# Altium project WiFi无线门禁_主机.PrjPCB
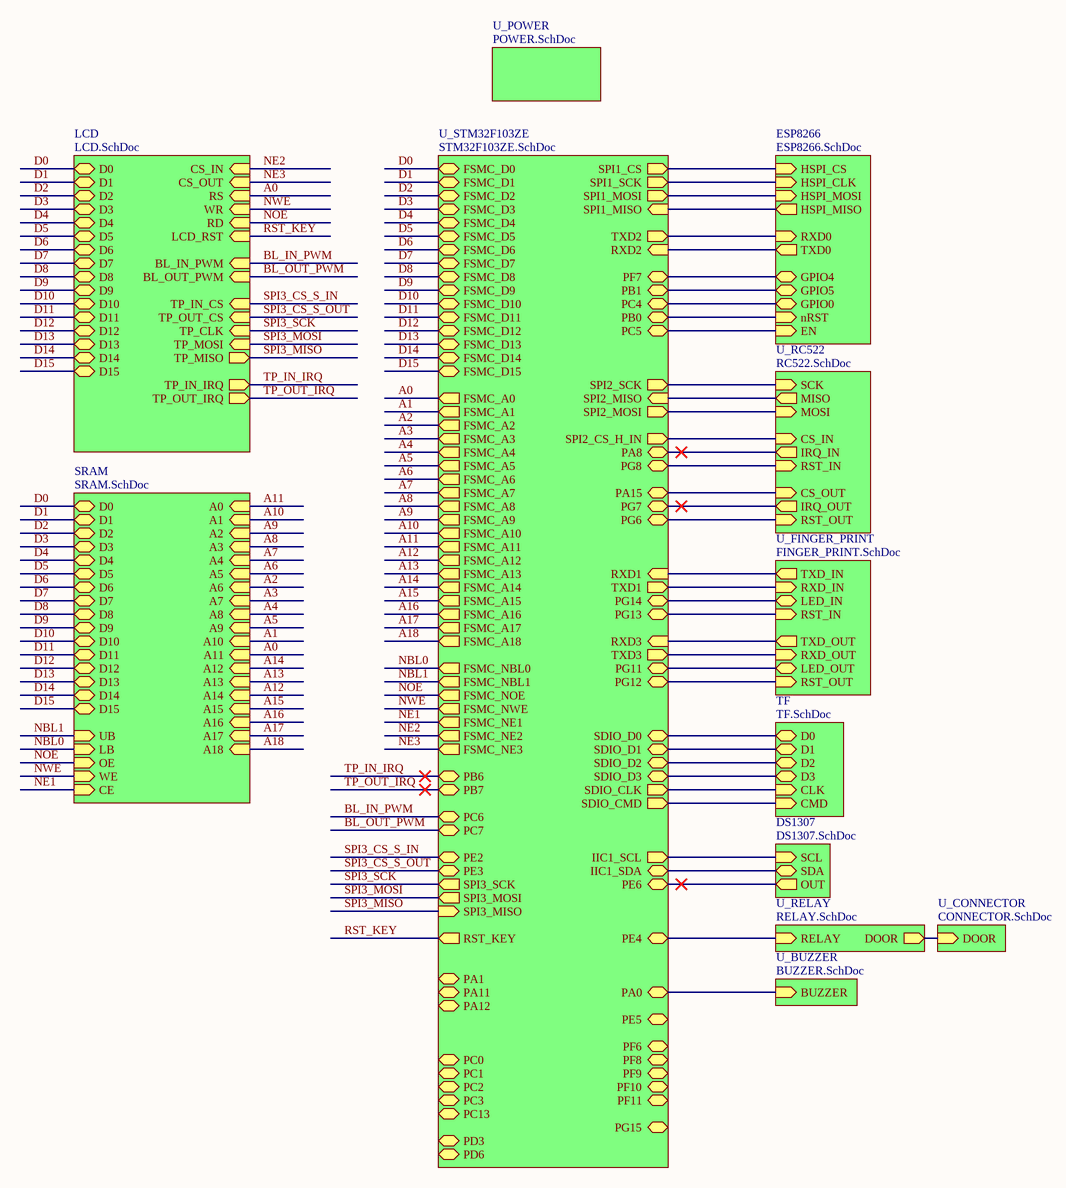
[diagram p0: WiFi无线门禁_主机.SchDoc]
13 sheets, 105 parts. Net scope: hierarchical (ports join the sheet entries above them; power ports are global).
Board file: WiFi无线门禁_主机.PcbDoc
Sheets:
  WiFi无线门禁_主机.SchDoc
    ESP8266 = ESP8266.SchDoc
    LCD = LCD.SchDoc
    TF = TF.SchDoc
    SRAM = SRAM.SchDoc
    DS1307 = DS1307.SchDoc
    U_RC522 = RC522.SchDoc
    U_FINGER_PRINT = FINGER_PRINT.SchDoc
    U_BUZZER = BUZZER.SchDoc
    U_RELAY = RELAY.SchDoc
    U_POWER = POWER.SchDoc
    U_STM32F103ZE = STM32F103ZE.SchDoc
    U_CONNECTOR = CONNECTOR.SchDoc

## Sheet WiFi无线门禁_主机.SchDoc
size A3

### Sub-sheets
DS1307 = DS1307.SchDoc: SCL (in), SDA (bidir), OUT (out)
ESP8266 = ESP8266.SchDoc: HSPI_CS (in), HSPI_CLK (in), HSPI_MISO (out), HSPI_MOSI (in), EN (in), nRST (in), TXD0 (out), RXD0 (in), GPIO5 (bidir), GPIO0 (bidir), GPIO4 (bidir)
LCD = LCD.SchDoc: D0 (bidir), D1 (bidir), D2 (bidir), D3 (bidir), D4 (bidir), D5 (bidir), D6 (bidir), D7 (bidir), D8 (bidir), D9 (bidir), D10 (bidir), D11 (bidir), D12 (bidir), D13 (bidir), D14 (bidir), D15 (bidir), CS_IN (in), RS (in), WR (in), RD (in), LCD_RST (in), BL_IN_PWM (in), TP_MISO (out), TP_MOSI (in), TP_CLK (in), TP_IN_CS (in), TP_IN_IRQ (out), CS_OUT (in), BL_OUT_PWM (in), TP_OUT_CS (in), TP_OUT_IRQ (out)
SRAM = SRAM.SchDoc: A0 (in), A1 (in), A2 (in), A3 (in), A4 (in), A5 (in), A6 (in), A7 (in), A8 (in), A9 (in), A10 (in), A11 (in), A12 (in), A13 (in), A14 (in), A15 (in), A16 (in), A17 (in), A18 (in), UB (in), LB (in), OE (in), WE (in), CE (in), D0 (bidir), D1 (bidir), D2 (bidir), D3 (bidir), D4 (bidir), D5 (bidir), D6 (bidir), D7 (bidir), D8 (bidir), D9 (bidir), D10 (bidir), D11 (bidir), D12 (bidir), D13 (bidir), D14 (bidir), D15 (bidir)
TF = TF.SchDoc: D2 (bidir), D3 (bidir), D0 (bidir), D1 (bidir), CMD (in), CLK (in)
U_BUZZER = BUZZER.SchDoc: BUZZER (in)
U_CONNECTOR = CONNECTOR.SchDoc: DOOR (in)
U_FINGER_PRINT = FINGER_PRINT.SchDoc: TXD_IN (out), RXD_IN (in), LED_IN (bidir), RST_IN (in), TXD_OUT (out), RXD_OUT (in), LED_OUT (bidir), RST_OUT (in)
U_POWER = POWER.SchDoc: no entries
U_RC522 = RC522.SchDoc: CS_IN (in), SCK (in), MOSI (in), MISO (out), IRQ_IN (out), RST_IN (in), CS_OUT (in), IRQ_OUT (out), RST_OUT (in)
U_RELAY = RELAY.SchDoc: RELAY (in), DOOR (out)
U_STM32F103ZE = STM32F103ZE.SchDoc: FSMC_D2 (bidir), FSMC_D3 (bidir), FSMC_D4 (bidir), FSMC_D5 (bidir), FSMC_D6 (bidir), FSMC_D7 (bidir), FSMC_D8 (bidir), FSMC_D9 (bidir), FSMC_D10 (bidir), FSMC_D11 (bidir), FSMC_D12 (bidir), FSMC_D13 (bidir), FSMC_D14 (bidir), FSMC_D15 (bidir), FSMC_D0 (bidir), FSMC_D1 (bidir), FSMC_A0 (out), FSMC_A1 (out), FSMC_A2 (out), FSMC_A3 (out), FSMC_A4 (out), FSMC_A5 (out), FSMC_A6 (out), FSMC_A7 (out), FSMC_A8 (out), FSMC_A9 (out), FSMC_A10 (out), FSMC_A11 (out), FSMC_A12 (out), FSMC_A13 (out), FSMC_A14 (out), FSMC_A15 (out), FSMC_A16 (out), FSMC_A17 (out), FSMC_A18 (out), FSMC_NBL0 (out), FSMC_NBL1 (out), FSMC_NOE (out), FSMC_NWE (out), FSMC_NE1 (out), FSMC_NE2 (out), FSMC_NE3 (out), RXD1 (in), TXD1 (out), RXD2 (in), TXD2 (out), RXD3 (in), TXD3 (out), SPI1_CS (out), SPI1_SCK (out), SPI1_MISO (in), SPI1_MOSI (out), SPI2_CS_H_IN (out), SPI2_SCK (out), SPI2_MISO (in), SPI2_MOSI (out), PB0 (bidir), SPI3_SCK (out), SPI3_MISO (in), SPI3_MOSI (out), SDIO_CMD (out), SDIO_D0 (bidir), SDIO_D1 (bidir), SDIO_D2 (bidir), SDIO_D3 (bidir), SDIO_CLK (out), PB1 (bidir), IIC1_SCL (out), IIC1_SDA (bidir), RST_KEY (out), PA0 (bidir), PA1 (bidir), PA8 (bidir), PA11 (bidir), PA12 (bidir), PA15 (bidir), PB6 (bidir), PB7 (bidir), PC0 (bidir), PC1 (bidir), PC2 (bidir), PC3 (bidir), PC4 (bidir), PC5 (bidir), PC6 (bidir), PC7 (bidir), PC13 (bidir), PD3 (bidir), PD6 (bidir), PE2 (bidir), PE3 (bidir), PE4 (bidir), PE5 (bidir), PE6 (bidir), PF7 (bidir), PF8 (bidir), PF9 (bidir), PF10 (bidir), PF11 (bidir), PF6 (bidir), PG6 (bidir), PG7 (bidir), PG8 (bidir), PG11 (bidir), PG12 (bidir), PG13 (bidir), PG14 (bidir), PG15 (bidir)

### Nets
A0: sheet LCD/RS, sheet SRAM/A11, sheet U_STM32F103ZE/FSMC_A0
A1: sheet SRAM/A10, sheet U_STM32F103ZE/FSMC_A1
A2: sheet SRAM/A6, sheet U_STM32F103ZE/FSMC_A2
A3: sheet SRAM/A7, sheet U_STM32F103ZE/FSMC_A3
A4: sheet SRAM/A8, sheet U_STM32F103ZE/FSMC_A4
A5: sheet SRAM/A9, sheet U_STM32F103ZE/FSMC_A5
A6: sheet SRAM/A5, sheet U_STM32F103ZE/FSMC_A6
A7: sheet SRAM/A4, sheet U_STM32F103ZE/FSMC_A7
A8: sheet SRAM/A3, sheet U_STM32F103ZE/FSMC_A8
A9: sheet SRAM/A2, sheet U_STM32F103ZE/FSMC_A9
A10: sheet SRAM/A1, sheet U_STM32F103ZE/FSMC_A10
A11: sheet SRAM/A0, sheet U_STM32F103ZE/FSMC_A11
A12: sheet SRAM/A14, sheet U_STM32F103ZE/FSMC_A12
A13: sheet SRAM/A13, sheet U_STM32F103ZE/FSMC_A13
A14: sheet SRAM/A12, sheet U_STM32F103ZE/FSMC_A14
A15: sheet SRAM/A15, sheet U_STM32F103ZE/FSMC_A15
A16: sheet SRAM/A16, sheet U_STM32F103ZE/FSMC_A16
A17: sheet SRAM/A17, sheet U_STM32F103ZE/FSMC_A17
A18: sheet SRAM/A18, sheet U_STM32F103ZE/FSMC_A18
BL_IN_PWM: sheet LCD/BL_IN_PWM, sheet U_STM32F103ZE/PC6
BL_OUT_PWM: sheet LCD/BL_OUT_PWM, sheet U_STM32F103ZE/PC7
D0: sheet LCD/D0, sheet SRAM/D0, sheet U_STM32F103ZE/FSMC_D0
D1: sheet LCD/D1, sheet SRAM/D1, sheet U_STM32F103ZE/FSMC_D1
D2: sheet LCD/D2, sheet SRAM/D2, sheet U_STM32F103ZE/FSMC_D2
D3: sheet LCD/D3, sheet SRAM/D3, sheet U_STM32F103ZE/FSMC_D3
D4: sheet LCD/D4, sheet SRAM/D4, sheet U_STM32F103ZE/FSMC_D4
D5: sheet LCD/D5, sheet SRAM/D5, sheet U_STM32F103ZE/FSMC_D5
D6: sheet LCD/D6, sheet SRAM/D6, sheet U_STM32F103ZE/FSMC_D6
D7: sheet LCD/D7, sheet SRAM/D7, sheet U_STM32F103ZE/FSMC_D7
D8: sheet LCD/D8, sheet SRAM/D8, sheet U_STM32F103ZE/FSMC_D8
D9: sheet LCD/D9, sheet SRAM/D9, sheet U_STM32F103ZE/FSMC_D9
D10: sheet LCD/D10, sheet SRAM/D10, sheet U_STM32F103ZE/FSMC_D10
D11: sheet LCD/D11, sheet SRAM/D11, sheet U_STM32F103ZE/FSMC_D11
D12: sheet LCD/D12, sheet SRAM/D12, sheet U_STM32F103ZE/FSMC_D12
D13: sheet LCD/D13, sheet SRAM/D13, sheet U_STM32F103ZE/FSMC_D13
D14: sheet LCD/D14, sheet SRAM/D14, sheet U_STM32F103ZE/FSMC_D14
D15: sheet LCD/D15, sheet SRAM/D15, sheet U_STM32F103ZE/FSMC_D15
EN: sheet ESP8266/EN, sheet U_STM32F103ZE/PC5
ESP8266_RST: sheet ESP8266/nRST, sheet U_STM32F103ZE/PB0
GPIO0: sheet ESP8266/GPIO0, sheet U_STM32F103ZE/PC4
GPIO4: sheet ESP8266/GPIO4, sheet U_STM32F103ZE/PF7
GPIO5: sheet ESP8266/GPIO5, sheet U_STM32F103ZE/PB1
GPIO12: sheet ESP8266/HSPI_MISO, sheet U_STM32F103ZE/SPI1_MISO
GPIO13: sheet ESP8266/HSPI_MOSI, sheet U_STM32F103ZE/SPI1_MOSI
GPIO14: sheet ESP8266/HSPI_CLK, sheet U_STM32F103ZE/SPI1_SCK
GPIO15: sheet ESP8266/HSPI_CS, sheet U_STM32F103ZE/SPI1_CS
NBL0: sheet SRAM/LB, sheet U_STM32F103ZE/FSMC_NBL0
NBL1: sheet SRAM/UB, sheet U_STM32F103ZE/FSMC_NBL1
NE1: sheet SRAM/CE, sheet U_STM32F103ZE/FSMC_NE1
NE2: sheet LCD/CS_IN, sheet U_STM32F103ZE/FSMC_NE2
NE3: sheet LCD/CS_OUT, sheet U_STM32F103ZE/FSMC_NE3
NOE: sheet LCD/RD, sheet SRAM/OE, sheet U_STM32F103ZE/FSMC_NOE
NWE: sheet LCD/WR, sheet SRAM/WE, sheet U_STM32F103ZE/FSMC_NWE
RST_KEY: sheet LCD/LCD_RST, sheet U_STM32F103ZE/RST_KEY  [project net nRST]
SPI3_CS_S_IN: sheet LCD/TP_IN_CS, sheet U_STM32F103ZE/PE2
SPI3_CS_S_OUT: sheet LCD/TP_OUT_CS, sheet U_STM32F103ZE/PE3
SPI3_MISO: sheet LCD/TP_MISO, sheet U_STM32F103ZE/SPI3_MISO
SPI3_MOSI: sheet LCD/TP_MOSI, sheet U_STM32F103ZE/SPI3_MOSI
SPI3_SCK: sheet LCD/TP_CLK, sheet U_STM32F103ZE/SPI3_SCK
TP_IN_IRQ: sheet LCD/TP_IN_IRQ, sheet U_STM32F103ZE/PB6
TP_OUT_IRQ: sheet LCD/TP_OUT_IRQ, sheet U_STM32F103ZE/PB7
NetDOOR_4: sheet U_RELAY/DOOR, sheet U_CONNECTOR/DOOR
NetFINGER_IN_3: sheet U_FINGER_PRINT/TXD_IN, sheet U_STM32F103ZE/RXD1
NetFINGER_IN_4: sheet U_FINGER_PRINT/RXD_IN, sheet U_STM32F103ZE/TXD1
NetFINGER_IN_5: sheet U_FINGER_PRINT/LED_IN, sheet U_STM32F103ZE/PG14
NetFINGER_IN_6: sheet U_FINGER_PRINT/RST_IN, sheet U_STM32F103ZE/PG13
NetFINGER_OUT_3: sheet U_FINGER_PRINT/TXD_OUT, sheet U_STM32F103ZE/RXD3
NetFINGER_OUT_4: sheet U_FINGER_PRINT/RXD_OUT, sheet U_STM32F103ZE/TXD3
NetFINGER_OUT_5: sheet U_FINGER_PRINT/LED_OUT, sheet U_STM32F103ZE/PG11
NetFINGER_OUT_6: sheet U_FINGER_PRINT/RST_OUT, sheet U_STM32F103ZE/PG12
NetMY1_3: sheet U_RELAY/RELAY, sheet U_STM32F103ZE/PE4
NetRB1_2: sheet U_BUZZER/BUZZER, sheet U_STM32F103ZE/PA0
NetRC522_IN_2: sheet U_RC522/RST_IN, sheet U_STM32F103ZE/PG8
NetRC522_IN_4: sheet U_RC522/IRQ_IN, sheet U_STM32F103ZE/PA8
NetRC522_IN_5: sheet U_RC522/MISO, sheet U_STM32F103ZE/SPI2_MISO
NetRC522_IN_6: sheet U_RC522/MOSI, sheet U_STM32F103ZE/SPI2_MOSI
NetRC522_IN_7: sheet U_RC522/SCK, sheet U_STM32F103ZE/SPI2_SCK
NetRC522_IN_8: sheet U_RC522/CS_IN, sheet U_STM32F103ZE/SPI2_CS_H_IN
NetRC522_OUT_2: sheet U_RC522/RST_OUT, sheet U_STM32F103ZE/PG6
NetRC522_OUT_4: sheet U_RC522/IRQ_OUT, sheet U_STM32F103ZE/PG7
NetRC522_OUT_8: sheet U_RC522/CS_OUT, sheet U_STM32F103ZE/PA15
NetRD1_1: sheet DS1307/SDA, sheet U_STM32F103ZE/IIC1_SDA
NetRD2_1: sheet DS1307/SCL, sheet U_STM32F103ZE/IIC1_SCL
NetRD3_2: sheet DS1307/OUT, sheet U_STM32F103ZE/PE6
NetRE2_2: sheet ESP8266/TXD0, sheet U_STM32F103ZE/RXD2
NetRE3_2: sheet ESP8266/RXD0, sheet U_STM32F103ZE/TXD2
NetRT1_2: sheet TF/D2, sheet U_STM32F103ZE/SDIO_D2
NetRT2_2: sheet TF/D3, sheet U_STM32F103ZE/SDIO_D3
NetRT3_2: sheet TF/CMD, sheet U_STM32F103ZE/SDIO_CMD
NetRT4_2: sheet TF/CLK, sheet U_STM32F103ZE/SDIO_CLK
NetRT5_2: sheet TF/D0, sheet U_STM32F103ZE/SDIO_D0
NetRT6_2: sheet TF/D1, sheet U_STM32F103ZE/SDIO_D1

## Sheet ESP8266.SchDoc
size A4
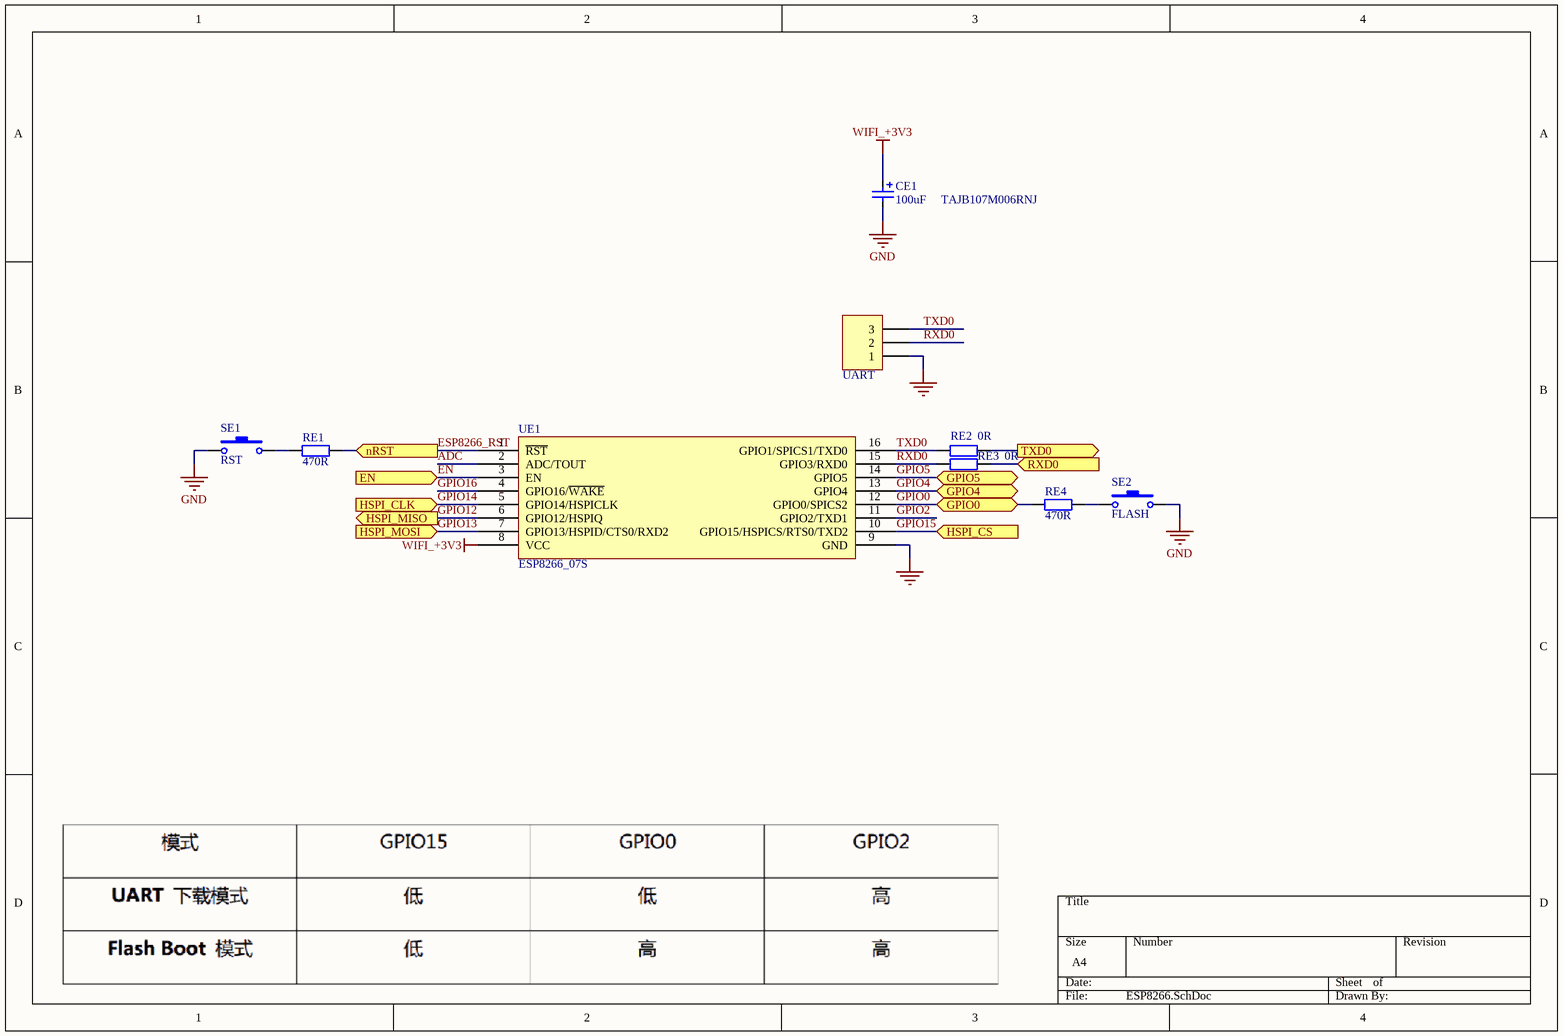
[diagram p1: ESP8266.SchDoc]

### Parts
CE1  value 100uF     TAJB107M006RNJ  [CAP_TAN_B_3518]  (hidden comment: Cap_Tan)
RE1  value 470R  [RESC1608N]  (hidden comment: Res1)
RE2  value 0R  [RESC1608N]  (hidden comment: Res1)
RE3  value 0R  [RESC1608N]  (hidden comment: Res1)
RE4  value 470R  [RESC1608N]  (hidden comment: Res1)
SE1  RST  [SW-3x6]
SE2  FLASH  [SW-3x6]
UART  Header 3  [HDR1X3]  (value not drawn)
UE1  ESP8266_07S  [ESP8266_07S]

### Ports
EN (in), GPIO0 (bidir), GPIO4 (bidir), GPIO5 (bidir), HSPI_CLK (in), HSPI_CS (in), HSPI_MISO (out), HSPI_MOSI (in), nRST (in), RXD0 (in), TXD0 (out)

### Nets
GND: CE1.2 SE1.2 SE2.2 UART.1 UE1.9(GND)
WIFI_+3V3: CE1.1 UE1.8(VCC)
ADC: UE1.2(ADC/TOUT)
EN: UE1.3(EN) ; port EN
ESP8266_RST: RE1.1 UE1.1(~{RST}) ; port nRST
GPIO0: RE4.1 UE1.12(GPIO0/SPICS2) ; port GPIO0
GPIO2: UE1.11(GPIO2/TXD1)
GPIO4: UE1.13(GPIO4) ; port GPIO4
GPIO5: UE1.14(GPIO5) ; port GPIO5
GPIO12: UE1.6(GPIO12/HSPIQ) ; port HSPI_MISO
GPIO13: UE1.7(GPIO13/HSPID/CTS0/RXD2) ; port HSPI_MOSI
GPIO14: UE1.5(GPIO14/HSPICLK) ; port HSPI_CLK
GPIO15: UE1.10(GPIO15/HSPICS/RTS0/TXD2) ; port HSPI_CS
GPIO16: UE1.4(GPIO16/~{WAKE})
RXD0: RE3.1 UART.2 UE1.15(GPIO3/RXD0)
TXD0: RE2.1 UART.3 UE1.16(GPIO1/SPICS1/TXD0)
NetRE1_2: RE1.2 SE1.1
NetRE2_2: RE2.2 ; port TXD0
NetRE3_2: RE3.2 ; port RXD0
NetRE4_2: RE4.2 SE2.1

### Library data of the parts
CE1 = Cap_Tan: Capacitor
RE1-RE4 = Res1: Resistor; Published: 8-Jun-2000; LatestRevisionDate: 17-Jul-2002; LatestRevisionNote: Re-released for DXP Platform.; PackageReference: AXIAL-0.4; Publisher: Altium Limited
SE1 SE2 = SW-PB: Switch; Published: 24-Mar-1999; LatestRevisionDate: 17-Jul-2002; LatestRevisionNote: Re-released for DXP Platform.; PackageReference: SPST-2; Publisher: Altium Limited; PackageDescription: Switch; 2 Leads
UART = Header 3: Header, 3-Pin; LatestRevisionDate: 17-Jul-2002; LatestRevisionNote: Re-released for DXP Platform.; Publisher: Altium Limited

## Sheet LCD.SchDoc
size A4
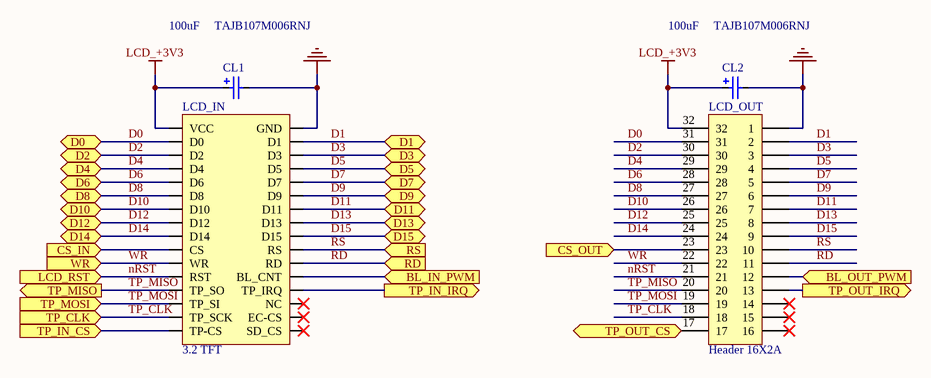
[diagram p2: LCD.SchDoc]

### Parts
CL1  value 100uF     TAJB107M006RNJ  [CAP_TAN_B_3518]  (hidden comment: Cap_Tan)
CL2  value 100uF     TAJB107M006RNJ  [CAP_TAN_B_3518]  (hidden comment: Cap_Tan)
LCD_IN  3.2 TFT  [LCD3.2]
LCD_OUT  Header 16X2A  [HDR2X16_CEN]

### Ports
BL_IN_PWM (in), BL_OUT_PWM (in), CS_IN (in), CS_OUT (in), D0 (bidir), D1 (bidir), D2 (bidir), D3 (bidir), D4 (bidir), D5 (bidir), D6 (bidir), D7 (bidir), D8 (bidir), D9 (bidir), D10 (bidir), D11 (bidir), D12 (bidir), D13 (bidir), D14 (bidir), D15 (bidir), LCD_RST (in), RD (in), RS (in), TP_CLK (in), TP_IN_CS (in), TP_IN_IRQ (out), TP_MISO (out), TP_MOSI (in), TP_OUT_CS (in), TP_OUT_IRQ (out), WR (in)

### Nets
GND: CL1.2 CL2.2 LCD_IN.2(GND) LCD_OUT.1
LCD_+3V3: CL1.1 CL2.1 LCD_IN.1(VCC) LCD_OUT.32
BL_IN_PWM: LCD_IN.24(BL_CNT) ; port BL_IN_PWM
BL_OUT_PWM: LCD_OUT.12 ; port BL_OUT_PWM
D0: LCD_IN.3(D0) LCD_OUT.31 ; port D0
D1: LCD_IN.4(D1) LCD_OUT.2 ; port D1
D2: LCD_IN.5(D2) LCD_OUT.30 ; port D2
D3: LCD_IN.6(D3) LCD_OUT.3 ; port D3
D4: LCD_IN.7(D4) LCD_OUT.29 ; port D4
D5: LCD_IN.8(D5) LCD_OUT.4 ; port D5
D6: LCD_IN.9(D6) LCD_OUT.28 ; port D6
D7: LCD_IN.10(D7) LCD_OUT.5 ; port D7
D8: LCD_IN.11(D8) LCD_OUT.27 ; port D8
D9: LCD_IN.12(D9) LCD_OUT.6 ; port D9
D10: LCD_IN.13(D10) LCD_OUT.26 ; port D10
D11: LCD_IN.14(D11) LCD_OUT.7 ; port D11
D12: LCD_IN.15(D12) LCD_OUT.25 ; port D12
D13: LCD_IN.16(D13) LCD_OUT.8 ; port D13
D14: LCD_IN.17(D14) LCD_OUT.24 ; port D14
D15: LCD_IN.18(D15) LCD_OUT.9 ; port D15
NE2: LCD_IN.19(CS) ; port CS_IN
NE3: LCD_OUT.23 ; port CS_OUT
nRST: LCD_IN.23(RST) LCD_OUT.21 ; port LCD_RST
RD: LCD_IN.22(RD) LCD_OUT.11 ; port RD  [project net NOE]
RS: LCD_IN.20(RS) LCD_OUT.10 ; port RS  [project net A0]
SPI3_CS_S_IN: LCD_IN.31(TP-CS) ; port TP_IN_CS
SPI3_CS_S_OUT: LCD_OUT.17 ; port TP_OUT_CS
TP_CLK: LCD_IN.29(TP_SCK) LCD_OUT.18 ; port TP_CLK  [project net SPI3_SCK]
TP_IN_IRQ: LCD_IN.26(TP_IRQ) ; port TP_IN_IRQ
TP_MISO: LCD_IN.25(TP_SO) LCD_OUT.20 ; port TP_MISO  [project net SPI3_MISO]
TP_MOSI: LCD_IN.27(TP_SI) LCD_OUT.19 ; port TP_MOSI  [project net SPI3_MOSI]
TP_OUT_IRQ: LCD_OUT.13 ; port TP_OUT_IRQ
WR: LCD_IN.21(WR) LCD_OUT.22 ; port WR  [project net NWE]

Not connected (* = marked no-connect by the designer): LCD_IN 28(NC)* 30(EC-CS)* 32(SD_CS)*; LCD_OUT 14* 15* 16*

### Library data of the parts
CL1 CL2 = Cap_Tan: Capacitor
LCD_IN = LCD3.2
LCD_OUT = Header 16X2A: Header, 16-Pin, Dual row; LatestRevisionDate: 17-Jul-2002; LatestRevisionNote: Re-released for DXP Platform.; Publisher: Altium Limited

## Sheet TF.SchDoc
size A4
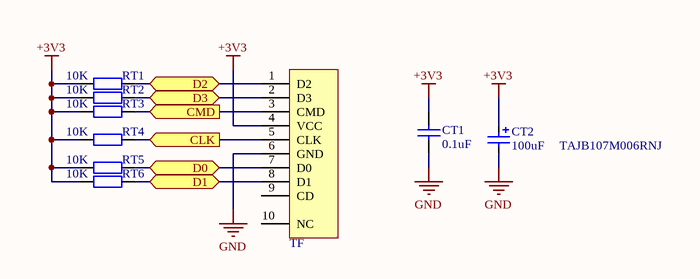
[diagram p3: TF.SchDoc]

### Parts
CT1  value 0.1uF  [CAPC1608N]  (hidden comment: Cap1)
CT2  value 100uF     TAJB107M006RNJ  [CAP_TAN_B_3518]  (hidden comment: Cap_Tan)
RT1  value 10K  [RESC1608N]  (hidden comment: Res1)
RT2  value 10K  [RESC1608N]  (hidden comment: Res1)
RT3  value 10K  [RESC1608N]  (hidden comment: Res1)
RT4  value 10K  [RESC1608N]  (hidden comment: Res1)
RT5  value 10K  [RESC1608N]  (hidden comment: Res1)
RT6  value 10K  [RESC1608N]  (hidden comment: Res1)
TF  TF  [TF-2]  (value not drawn)

### Ports
CLK (in), CMD (in), D0 (bidir), D1 (bidir), D2 (bidir), D3 (bidir)

### Nets
+3V3: CT1.2 CT2.1 RT1.1 RT2.1 RT3.1 RT4.1 RT5.1 RT6.1 TF.4(VCC)
GND: CT1.1 CT2.2 TF.6(GND)
NetRT1_2: RT1.2 TF.1(D2) ; port D2
NetRT2_2: RT2.2 TF.2(D3) ; port D3
NetRT3_2: RT3.2 TF.3(CMD) ; port CMD
NetRT4_2: RT4.2 TF.5(CLK) ; port CLK
NetRT5_2: RT5.2 TF.7(D0) ; port D0
NetRT6_2: RT6.2 TF.8(D1) ; port D1

Not connected (* = marked no-connect by the designer): TF 9(CD) 10(NC)

### Library data of the parts
CT1 = Cap1: Capacitor; Published: 8-Jun-2000; LatestRevisionDate: 17-Jul-2002; LatestRevisionNote: Re-released for DXP Platform.; PackageReference: RAD-0.3; Publisher: Altium Limited
CT2 = Cap_Tan: Capacitor
RT1-RT6 = Res1: Resistor; Published: 8-Jun-2000; LatestRevisionDate: 17-Jul-2002; LatestRevisionNote: Re-released for DXP Platform.; PackageReference: AXIAL-0.4; Publisher: Altium Limited
TF = TF2

## Sheet SRAM.SchDoc
size A4
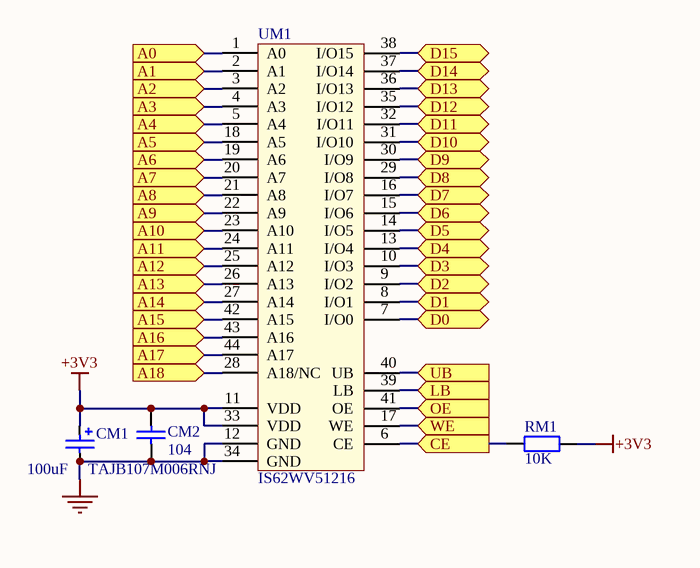
[diagram p4: SRAM.SchDoc]

### Parts
CM1  value 100uF     TAJB107M006RNJ  [CAP_TAN_B_3518]  (hidden comment: Cap_Tan)
CM2  value 104  [CAPC1608N]  (hidden comment: Cap1)
RM1  value 10K  [RESC1608N]  (hidden comment: Res1)
UM1  IS62WV51216  [TSOP44]

### Ports
A0 (in), A1 (in), A2 (in), A3 (in), A4 (in), A5 (in), A6 (in), A7 (in), A8 (in), A9 (in), A10 (in), A11 (in), A12 (in), A13 (in), A14 (in), A15 (in), A16 (in), A17 (in), A18 (in), CE (in), D0 (bidir), D1 (bidir), D2 (bidir), D3 (bidir), D4 (bidir), D5 (bidir), D6 (bidir), D7 (bidir), D8 (bidir), D9 (bidir), D10 (bidir), D11 (bidir), D12 (bidir), D13 (bidir), D14 (bidir), D15 (bidir), LB (in), OE (in), UB (in), WE (in)

### Nets
+3V3: CM1.1 CM2.2 RM1.1 UM1.11(VDD) UM1.33(VDD)
GND: CM1.2 CM2.1 UM1.12(GND) UM1.34(GND)
A0: UM1.24(A11) ; port A11
A1: UM1.23(A10) ; port A10
A2: UM1.19(A6) ; port A6
A3: UM1.20(A7) ; port A7
A4: UM1.21(A8) ; port A8
A5: UM1.22(A9) ; port A9
A6: UM1.18(A5) ; port A5
A7: UM1.5(A4) ; port A4
A8: UM1.4(A3) ; port A3
A9: UM1.3(A2) ; port A2
A10: UM1.2(A1) ; port A1
A11: UM1.1(A0) ; port A0
A12: UM1.27(A14) ; port A14
A13: UM1.26(A13) ; port A13
A14: UM1.25(A12) ; port A12
A15: UM1.42(A15) ; port A15
A16: UM1.43(A16) ; port A16
A17: UM1.44(A17) ; port A17
A18: UM1.28(A18/NC) ; port A18
D0: UM1.7(I/O0) ; port D0
D1: UM1.8(I/O1) ; port D1
D2: UM1.9(I/O2) ; port D2
D3: UM1.10(I/O3) ; port D3
D4: UM1.13(I/O4) ; port D4
D5: UM1.14(I/O5) ; port D5
D6: UM1.15(I/O6) ; port D6
D7: UM1.16(I/O7) ; port D7
D8: UM1.29(I/O8) ; port D8
D9: UM1.30(I/O9) ; port D9
D10: UM1.31(I/O10) ; port D10
D11: UM1.32(I/O11) ; port D11
D12: UM1.35(I/O12) ; port D12
D13: UM1.36(I/O13) ; port D13
D14: UM1.37(I/O14) ; port D14
D15: UM1.38(I/O15) ; port D15
NBL0: UM1.39(LB) ; port LB
NBL1: UM1.40(UB) ; port UB
NE1: RM1.2 UM1.6(CE) ; port CE
NOE: UM1.41(OE) ; port OE
NWE: UM1.17(WE) ; port WE

### Library data of the parts
CM1 = Cap_Tan: Capacitor
CM2 = Cap1: Capacitor; Published: 8-Jun-2000; LatestRevisionDate: 17-Jul-2002; LatestRevisionNote: Re-released for DXP Platform.; PackageReference: RAD-0.3; Publisher: Altium Limited
RM1 = Res1: Resistor; Published: 8-Jun-2000; LatestRevisionDate: 17-Jul-2002; LatestRevisionNote: Re-released for DXP Platform.; PackageReference: AXIAL-0.4; Publisher: Altium Limited
UM1 = IS61LV51216

## Sheet DS1307.SchDoc
size A4
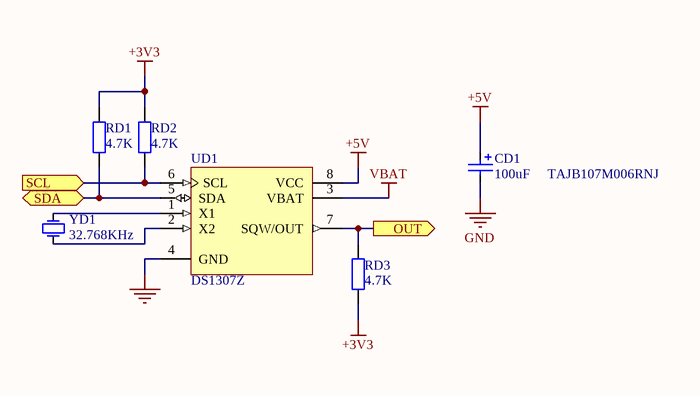
[diagram p5: DS1307.SchDoc]

### Parts
CD1  value 100uF     TAJB107M006RNJ  [CAP_TAN_B_3518]  (hidden comment: Cap_Tan)
RD1  value 4.7K  [RESC1608N]  (hidden comment: Res1)
RD2  value 4.7K  [RESC1608N]  (hidden comment: Res1)
RD3  value 4.7K  [RESC1608N]  (hidden comment: Res1)
UD1  DS1307Z  [SOIC8_L]
YD1  32.768KHz  [XTAL-206]

### Ports
OUT (out), SCL (in), SDA (bidir)

### Nets
+3V3: RD1.2 RD2.2 RD3.1
+5V: CD1.1 UD1.8(VCC)
GND: CD1.2 UD1.4(GND)
VBAT: UD1.3(VBAT)
NetRD1_1: RD1.1 UD1.5(SDA) ; port SDA
NetRD2_1: RD2.1 UD1.6(SCL) ; port SCL
NetRD3_2: RD3.2 UD1.7(SQW/OUT) ; port OUT
NetUD1_1: UD1.1(X1) YD1.2(OSC2)
NetUD1_2: UD1.2(X2) YD1.1(OSC1)

### Library data of the parts
CD1 = Cap_Tan: Capacitor
RD1-RD3 = Res1: Resistor; Published: 8-Jun-2000; LatestRevisionDate: 17-Jul-2002; LatestRevisionNote: Re-released for DXP Platform.; PackageReference: AXIAL-0.4; Publisher: Altium Limited
UD1 = DS1307Z: 64 X 8 Serial Real-Time Clock; Published: 13-Oct-2000; LatestRevisionDate: 13-Apr-2006; LatestRevisionNote: IPC-7351 Footprint Added.; DatasheetVersion: 10-Aug-1999; PackageVersion: 1999; PackageReference: SOIC8N; Publisher: Altium Limited; PackageDescription: 8-Pin Small Outline Integrated Circuit 1.27 mm Pitch; Code_IPC: SOIC127P600-8; ComponentLink1Description: Manufacturer Link; ComponentLink1URL: http://www.maxim-ic.com/; ComponentLink2Description: Datasheet; ComponentLink2URL: http://pdfserv.maxim-ic.com/en/ds/DS1307.pdf; ComponentLink3Description: Discontinuation Notice; ComponentLink3URL: http://www.maxim-ic.com/qa/pdfs/non-obsolescence-letter.pdf
YD1 = XTAL: Crystal Oscillator; Published: 8-Jun-2000; LatestRevisionDate: 17-Jul-2002; LatestRevisionNote: Re-released for DXP Platform.; PackageReference: R38; Publisher: Altium Limited; PackageDescription: Crystal, Thru-Hole; 2 Leads; Body 3.1 x 8.2 mm (Dia.xH)

## Sheet RC522.SchDoc
size A4
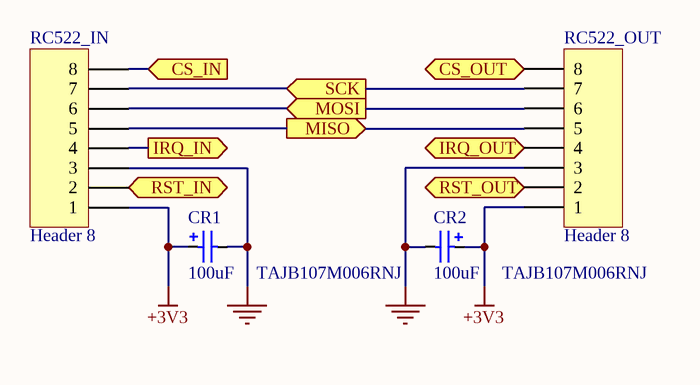
[diagram p6: RC522.SchDoc]

### Parts
CR1  value 100uF     TAJB107M006RNJ  [CAP_TAN_B_3518]  (hidden comment: Cap_Tan)
CR2  value 100uF     TAJB107M006RNJ  [CAP_TAN_B_3518]  (hidden comment: Cap_Tan)
RC522_IN  Header 8  [HX2.54-8]
RC522_OUT  Header 8  [HX2.54-8]

### Ports
CS_IN (in), CS_OUT (in), IRQ_IN (out), IRQ_OUT (out), MISO (out), MOSI (in), RST_IN (in), RST_OUT (in), SCK (in)

### Nets
+3V3: CR1.1 CR2.1 RC522_IN.1 RC522_OUT.1
GND: CR1.2 CR2.2 RC522_IN.3 RC522_OUT.3
NetRC522_IN_2: RC522_IN.2 ; port RST_IN
NetRC522_IN_4: RC522_IN.4 ; port IRQ_IN
NetRC522_IN_5: RC522_IN.5 RC522_OUT.5 ; port MISO
NetRC522_IN_6: RC522_IN.6 RC522_OUT.6 ; port MOSI
NetRC522_IN_7: RC522_IN.7 RC522_OUT.7 ; port SCK
NetRC522_IN_8: RC522_IN.8 ; port CS_IN
NetRC522_OUT_2: RC522_OUT.2 ; port RST_OUT
NetRC522_OUT_4: RC522_OUT.4 ; port IRQ_OUT
NetRC522_OUT_8: RC522_OUT.8 ; port CS_OUT

### Library data of the parts
CR1 CR2 = Cap_Tan: Capacitor
RC522_IN RC522_OUT = Header 8: Header, 8-Pin; LatestRevisionDate: 17-Jul-2002; LatestRevisionNote: Re-released for DXP Platform.; Publisher: Altium Limited

## Sheet FINGER_PRINT.SchDoc
size A4
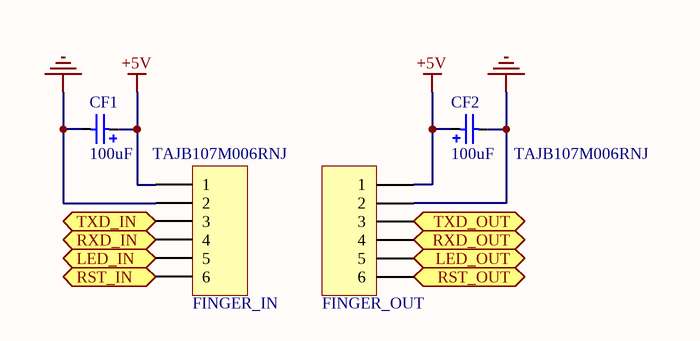
[diagram p7: FINGER_PRINT.SchDoc]

### Parts
CF1  value 100uF     TAJB107M006RNJ  [CAP_TAN_B_3518]  (hidden comment: Cap_Tan)
CF2  value 100uF     TAJB107M006RNJ  [CAP_TAN_B_3518]  (hidden comment: Cap_Tan)
FINGER_IN  Header 6  [HX2.54-6]  (value not drawn)
FINGER_OUT  Header 6  [HX2.54-6]  (value not drawn)

### Ports
LED_IN (bidir), LED_OUT (bidir), RST_IN (in), RST_OUT (in), RXD_IN (in), RXD_OUT (in), TXD_IN (out), TXD_OUT (out)

### Nets
+5V: CF1.1 CF2.1 FINGER_IN.1 FINGER_OUT.1
GND: CF1.2 CF2.2 FINGER_IN.2 FINGER_OUT.2
NetFINGER_IN_3: FINGER_IN.3 ; port TXD_IN
NetFINGER_IN_4: FINGER_IN.4 ; port RXD_IN
NetFINGER_IN_5: FINGER_IN.5 ; port LED_IN
NetFINGER_IN_6: FINGER_IN.6 ; port RST_IN
NetFINGER_OUT_3: FINGER_OUT.3 ; port TXD_OUT
NetFINGER_OUT_4: FINGER_OUT.4 ; port RXD_OUT
NetFINGER_OUT_5: FINGER_OUT.5 ; port LED_OUT
NetFINGER_OUT_6: FINGER_OUT.6 ; port RST_OUT

### Library data of the parts
CF1 CF2 = Cap_Tan: Capacitor
FINGER_IN FINGER_OUT = Header 6: Header, 6-Pin; LatestRevisionDate: 17-Jul-2002; LatestRevisionNote: Re-released for DXP Platform.; Publisher: Altium Limited

## Sheet BUZZER.SchDoc
size A4
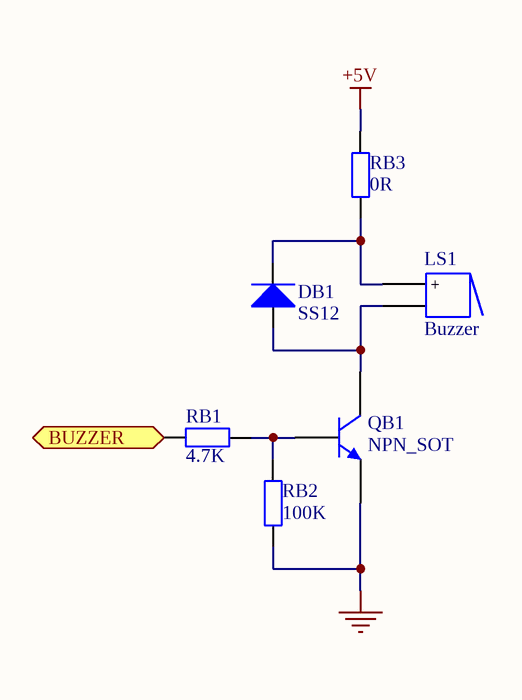
[diagram p8: BUZZER.SchDoc]

### Parts
DB1  SMA: SS12  [DO-214AC]  (hidden comment: Diode)
LS1  Buzzer  [Buzzer 5]
QB1  NPN_SOT  [SOT23_N]
RB1  value 4.7K  [RESC1608N]  (hidden comment: Res1)
RB2  value 100K  [RESC1608N]  (hidden comment: Res1)
RB3  value 0R  [RESC1608N]  (hidden comment: Res1)

### Ports
BUZZER (in)

### Nets
+5V: RB3.2
GND: QB1.2(E) RB2.2
NetDB1_1: DB1.1(A) LS1.2 QB1.1(C)
NetDB1_2: DB1.2(K) LS1.1(+) RB3.1
NetQB1_3: QB1.3(B) RB1.1 RB2.1
NetRB1_2: RB1.2 ; port BUZZER

### Library data of the parts
LS1 = Buzzer: Magnetic Transducer Buzzer; Published: 24-Mar-1999; LatestRevisionDate: 17-Dec-2003; LatestRevisionNote: Schematic revised, PCB Footprint replaced.; DatasheetVersion: 17-Dec-2003; PackageReference: ABSM-1574; Publisher: Altium Limited; PackageDescription: Magnetic Transducer Buzzer; ComponentLink1Description: Manufacturer Link; ComponentLink1URL: http://www.megastar.com/linecard/buzzmode/index.php
QB1 = NPN_SOT: NPN Bipolar Transistor; Published: 8-Jun-2000; LatestRevisionDate: 17-Jul-2002; LatestRevisionNote: Re-released for DXP Platform.; PackageReference: TO-226-AA; Publisher: Altium Limited; PackageDescription: TO, Flat Index; 3 In-Line, Axial Leads; Body Dia. 4.8mm; Leads 0.55 x 0.51 mm (max); Code_JEDEC: TO-226-AA
RB1-RB3 = Res1: Resistor; Published: 8-Jun-2000; LatestRevisionDate: 17-Jul-2002; LatestRevisionNote: Re-released for DXP Platform.; PackageReference: AXIAL-0.4; Publisher: Altium Limited

## Sheet RELAY.SchDoc
size A4
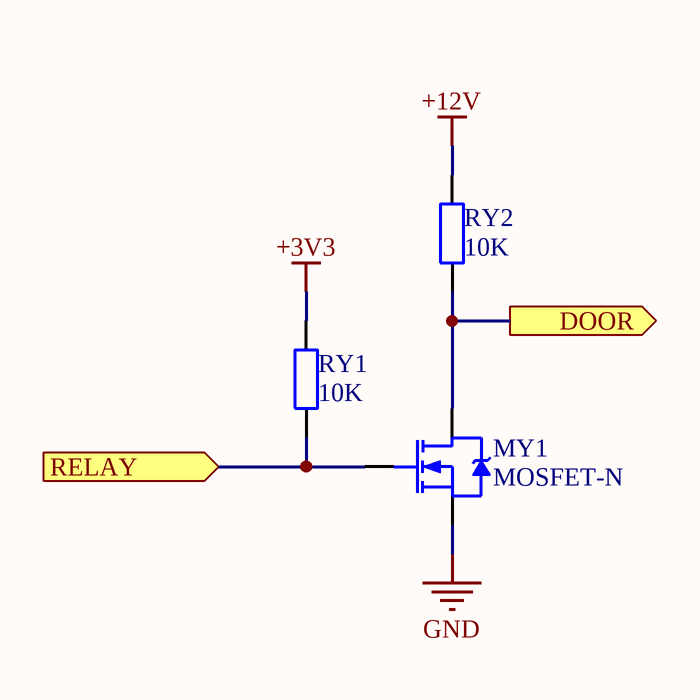
[diagram p9: RELAY.SchDoc]

### Parts
MY1  MOSFET-N  [SOT23_N]
RY1  value 10K  [RESC1608N]  (hidden comment: Res1)
RY2  value 10K  [RESC1608N]  (hidden comment: Res1)

### Ports
DOOR (out), RELAY (in)

### Nets
+3V3: RY1.2
+12V: RY2.2
GND: MY1.2(S)
NetDOOR_4: MY1.1(D) RY2.1 ; port DOOR
NetMY1_3: MY1.3(G) RY1.1 ; port RELAY

### Library data of the parts
MY1 = SI2300
RY1 RY2 = Res1: Resistor; Published: 8-Jun-2000; LatestRevisionDate: 17-Jul-2002; LatestRevisionNote: Re-released for DXP Platform.; PackageReference: AXIAL-0.4; Publisher: Altium Limited

## Sheet POWER.SchDoc
size A4
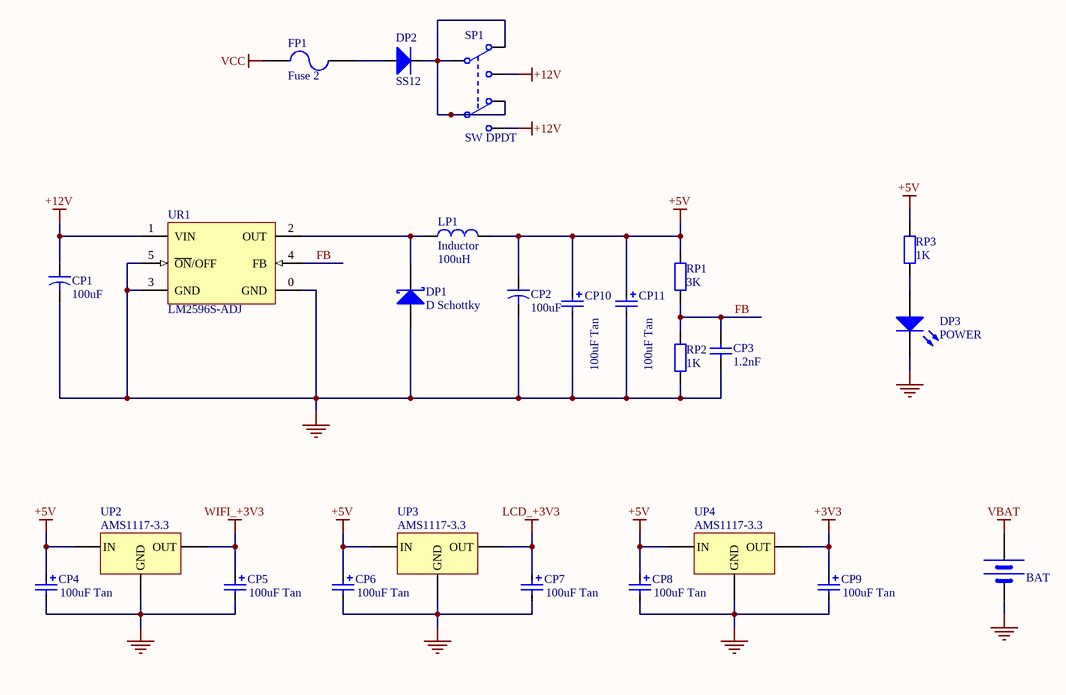
[diagram p10: POWER.SchDoc]

### Parts
BAT  BATT  [BATM]  (value not drawn)
CP1  value 100uF  [SMD-EC-F10]  (hidden comment: Cap3)
CP2  value 100uF  [SMD-EC-F10]  (hidden comment: Cap3)
CP3  value 1.2nF  [CAPC1608N]  (hidden comment: Cap1)
CP4  value 100uF Tan  [CAP_TAN_B_3518]  (hidden comment: Cap_Tan)
CP5  value 100uF Tan  [CAP_TAN_B_3518]  (hidden comment: Cap_Tan)
CP6  value 100uF Tan  [CAP_TAN_B_3518]  (hidden comment: Cap_Tan)
CP7  value 100uF Tan  [CAP_TAN_B_3518]  (hidden comment: Cap_Tan)
CP8  value 100uF Tan  [CAP_TAN_B_3518]  (hidden comment: Cap_Tan)
CP9  value 100uF Tan  [CAP_TAN_B_3518]  (hidden comment: Cap_Tan)
CP10  value 100uF Tan  [CAP_TAN_B_3518]  (hidden comment: Cap_Tan)
CP11  value 100uF Tan  [CAP_TAN_B_3518]  (hidden comment: Cap_Tan)
DP1  D Schottky  [DO-214AC]
DP2  SMA: SS12  [DO-214AC]  (hidden comment: Diode)
DP3  POWER  [CD2012-0805]
FP1  Fuse 2  [1812]
LP1  Inductor  value 100uH  [贴片680u]
RP1  value 3K  [RESC1608N]  (hidden comment: Res1)
RP2  value 1K  [RESC1608N]  (hidden comment: Res1)
RP3  value 1K  [RESC1608N]  (hidden comment: Res1)
SP1  SW DPDT  [DPDT-6 x 2.0]
UP2  AMS1117-3.3  [SOT-223_N]
UP3  AMS1117-3.3  [SOT-223_N]
UP4  AMS1117-3.3  [SOT-223_N]
UR1  LM2596S-ADJ  [TO-263]

### Nets
+3V3: CP9.1 UP4.2(OUT)
+5V: CP2.1 CP4.1 CP6.1 CP8.1 CP10.1 CP11.1 LP1.2 RP1.2 RP3.1 UP2.3(IN) UP3.3(IN) UP4.3(IN)
+12V: CP1.1 SP1.1 SP1.6 UR1.1(VIN)
GND: BAT.2(GND) CP1.2 CP2.2 CP3.1 CP4.2 CP5.2 CP6.2 CP7.2 CP8.2 CP9.2 CP10.2 CP11.2 DP1.1(A) DP3.2(K) RP2.2 UP2.1(GND) UP3.1(GND) UP4.1(GND) UR1.0(GND) UR1.3(GND) UR1.5(~{ON}/OFF)
LCD_+3V3: CP7.1 UP3.2(OUT)
VBAT: BAT.1(VCC)
VCC: FP1.1
WIFI_+3V3: CP5.1 UP2.2(OUT)
FB: CP3.2 RP1.1 RP2.1 UR1.4(FB)
NetDP1_2: DP1.2(K) LP1.1 UR1.2(OUT)
NetDP2_1: DP2.1(A) FP1.2
NetDP2_2: DP2.2(K) SP1.2 SP1.3 SP1.4 SP1.5
NetDP3_1: DP3.1(A) RP3.2

### Library data of the parts
BAT = BAT
CP1 CP2 = Cap3: Capacitor; Published: 23-Sep-2002; PackageReference: CAPR5-4X5; Publisher: Altium Limited
CP3 = Cap1: Capacitor; Published: 8-Jun-2000; LatestRevisionDate: 17-Jul-2002; LatestRevisionNote: Re-released for DXP Platform.; PackageReference: RAD-0.3; Publisher: Altium Limited
CP4-CP11 = Cap_Tan: Capacitor
DP1 = D Schottky: Schottky Diode; Published: 8-Jun-2000; LatestRevisionDate: 17-Jul-2002; LatestRevisionNote: Re-released for DXP Platform.; PackageReference: SMB; Publisher: Altium Limited; Code_JEDEC: DO-214-AA
DP3 = LED2: Typical RED, GREEN, YELLOW, AMBER GaAs LED; Published: 8-Jun-2000; LatestRevisionDate: 17-Jul-2002; LatestRevisionNote: Re-released for DXP Platform.; PackageVersion: Feb-2002; PackageReference: 3.2X1.6X1.1; Publisher: Altium Limited; PackageDescription: SM LED; 2 Flat Leads
FP1 = Fuse 2: Fuse; Published: 8-Jun-2000; LatestRevisionDate: 17-Jul-2002; LatestRevisionNote: Re-released for DXP Platform.; PackageReference: PIN-W2/E2.8; Publisher: Altium Limited; PackageDescription: Thru-Hole; 2 Leads
LP1 = Inductor: Code_IEC: 1005; Published: 8-Jun-2000; LatestRevisionDate: 29-May-2009; LatestRevisionNote: IPC-7351 Footprint Added.; PackageReference: 0402-A; Publisher: Altium Limited; PackageDescription: Chip Inductor; Code_JEITA: 0402
RP1-RP3 = Res1: Resistor; Published: 8-Jun-2000; LatestRevisionDate: 17-Jul-2002; LatestRevisionNote: Re-released for DXP Platform.; PackageReference: AXIAL-0.4; Publisher: Altium Limited
SP1 = SW DPDT: Switch; Published: 24-Mar-1999; LatestRevisionDate: 29-May-2009; LatestRevisionNote: IPC-7351 Footprint Added.; PackageVersion: Mar-2001; PackageReference: SOT23-6; Publisher: Altium Limited; PackageDescription: 6-Pin SOT-23 Package 0.95 mm Pitch, 2.7 mm Lead Span; Code_JEITA: SC-74; Code_IPC: SOT26A-6
UR1 = LM2575T-ADJ: SIMPLE SWITCHER 1A Step-Down Voltage Regulator; Manufacturer: National Semiconductor; PackageTopMarking: NSUZXYTT*LM2575T*-ADJ P+; PowerWise: N; FirstPublished: 4-Dec-2008; DatasheetVersion: Apr-2007; PackageVersion: revJ, Jan-1992; PackageReference: T05A; Publisher: Altium Limited; PackageDescription: TO-220, Molded, 5 Lead, Straight; CompType: Switcher; PartNumber: LM2575T-ADJ; RoHS: O; PinCount: 5; DigiKeyPartNumber: LM2575T-ADJNS-ND; Code_JEDEC: TO-220-AB; ComponentLink1Description: LM2575 Datasheet; ComponentLink1URL: http://www.national.com/ds/LM/LM2575.pdf; ComponentLink2Description: LM2575 Web Page; ComponentLink2URL: http://www.national.com/pf/LM/LM2575.html; ComponentLink3Description: T05A Package Page; ComponentLink3URL: http://www.national.com/packaging/folders/t05a.html

## Sheet STM32F103ZE.SchDoc
size A3
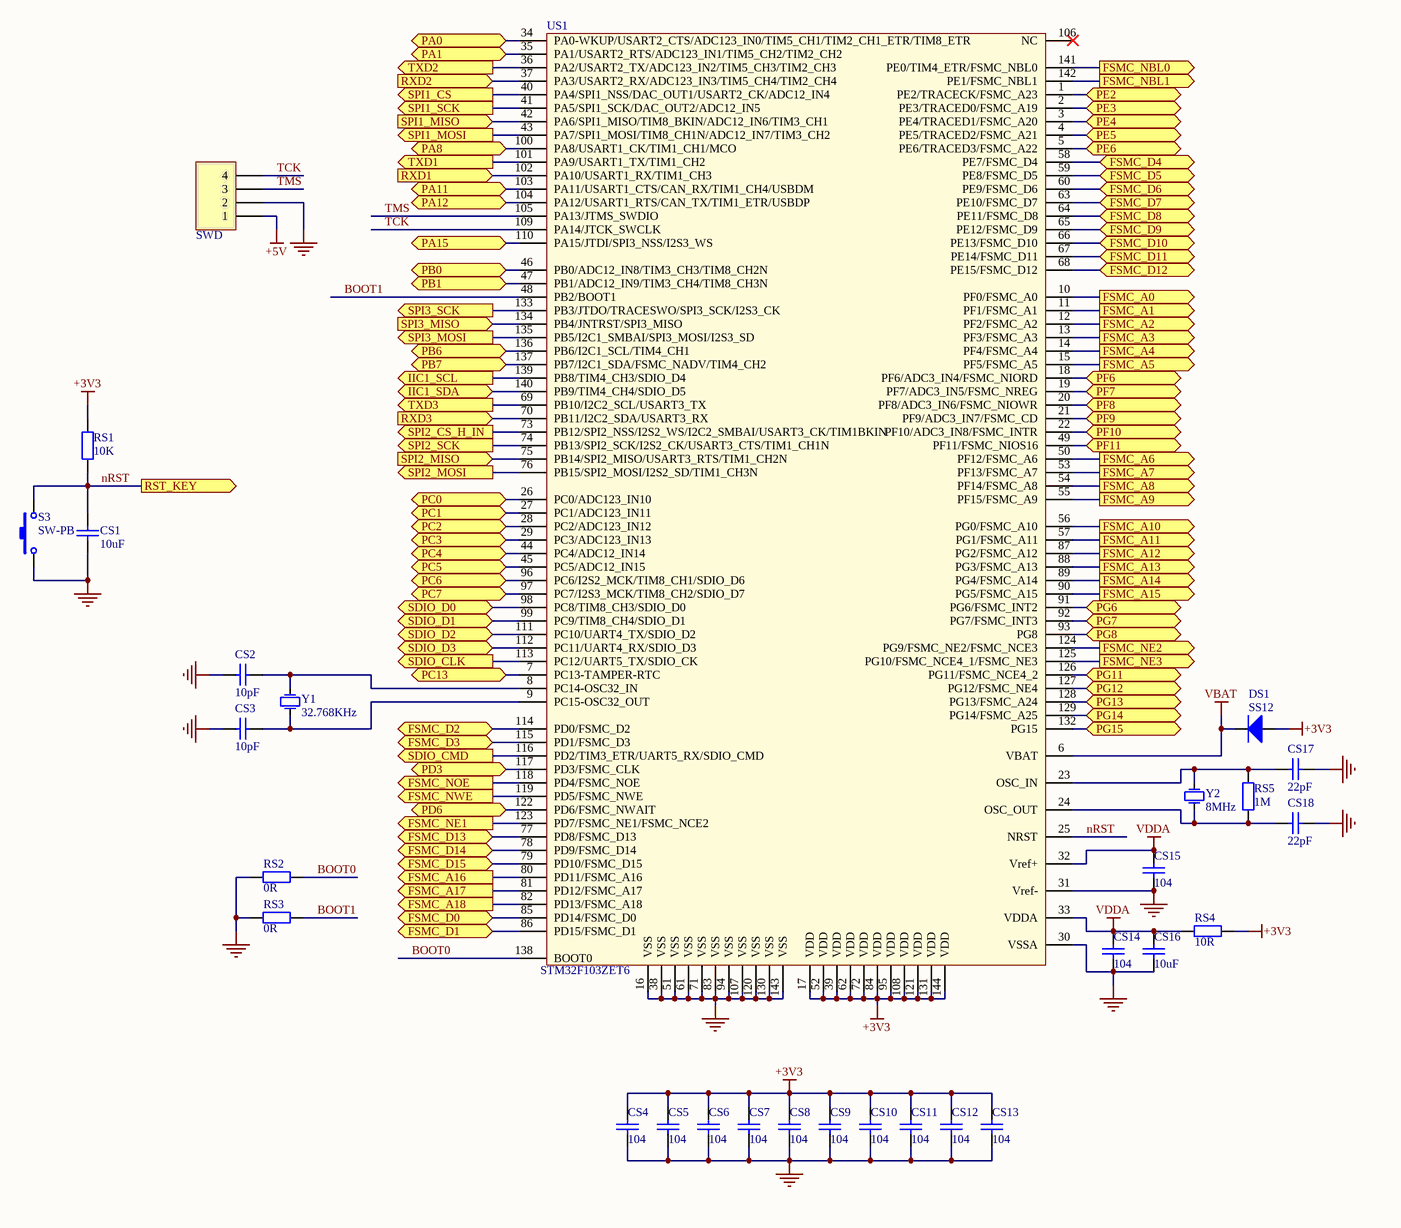
[diagram p11: STM32F103ZE.SchDoc]

### Parts
CS1  value 10uF  [CAPC1608N]  (hidden comment: Cap1)
CS2  value 10pF  [CAPC1608N]  (hidden comment: Cap1)
CS3  value 10pF  [CAPC1608N]  (hidden comment: Cap1)
CS4  value 104  [CAPC1608N]  (hidden comment: Cap1)
CS5  value 104  [CAPC1608N]  (hidden comment: Cap1)
CS6  value 104  [CAPC1608N]  (hidden comment: Cap1)
CS7  value 104  [CAPC1608N]  (hidden comment: Cap1)
CS8  value 104  [CAPC1608N]  (hidden comment: Cap1)
CS9  value 104  [CAPC1608N]  (hidden comment: Cap1)
CS10  value 104  [CAPC1608N]  (hidden comment: Cap1)
CS11  value 104  [CAPC1608N]  (hidden comment: Cap1)
CS12  value 104  [CAPC1608N]  (hidden comment: Cap1)
CS13  value 104  [CAPC1608N]  (hidden comment: Cap1)
CS14  value 104  [CAPC1608N]  (hidden comment: Cap1)
CS15  value 104  [CAPC1608N]  (hidden comment: Cap1)
CS16  value 10uF  [CAPC1608N]  (hidden comment: Cap1)
CS17  value 22pF  [CAPC1608N]  (hidden comment: Cap1)
CS18  value 22pF  [CAPC1608N]  (hidden comment: Cap1)
DS1  SMA: SS12  [DO-214AC]  (hidden comment: Diode)
RS1  value 10K  [RESC1608N]  (hidden comment: Res1)
RS2  value 0R  [RESC1608N]  (hidden comment: Res1)
RS3  value 0R  [RESC1608N]  (hidden comment: Res1)
RS4  value 10R  [RESC1608N]  (hidden comment: Res1)
RS5  value 1M  [RESC1608N]  (hidden comment: Res1)
S3  SW-PB  [SW-3x6]
SWD  Header 4  [HDR1X4]  (value not drawn)
US1  STM32F103ZET6  [LQFP144]
Y1  32.768KHz  [XTAL-206]
Y2  8MHz  [49S]

### Ports
FSMC_A0 (out), FSMC_A1 (out), FSMC_A2 (out), FSMC_A3 (out), FSMC_A4 (out), FSMC_A5 (out), FSMC_A6 (out), FSMC_A7 (out), FSMC_A8 (out), FSMC_A9 (out), FSMC_A10 (out), FSMC_A11 (out), FSMC_A12 (out), FSMC_A13 (out), FSMC_A14 (out), FSMC_A15 (out), FSMC_A16 (out), FSMC_A17 (out), FSMC_A18 (out), FSMC_D0 (bidir), FSMC_D1 (bidir), FSMC_D2 (bidir), FSMC_D3 (bidir), FSMC_D4 (bidir), FSMC_D5 (bidir), FSMC_D6 (bidir), FSMC_D7 (bidir), FSMC_D8 (bidir), FSMC_D9 (bidir), FSMC_D10 (bidir), FSMC_D11 (bidir), FSMC_D12 (bidir), FSMC_D13 (bidir), FSMC_D14 (bidir), FSMC_D15 (bidir), FSMC_NBL0 (out), FSMC_NBL1 (out), FSMC_NE1 (out), FSMC_NE2 (out), FSMC_NE3 (out), FSMC_NOE (out), FSMC_NWE (out), IIC1_SCL (out), IIC1_SDA (bidir), PA0 (bidir), PA1 (bidir), PA8 (bidir), PA11 (bidir), PA12 (bidir), PA15 (bidir), PB0 (bidir), PB1 (bidir), PB6 (bidir), PB7 (bidir), PC0 (bidir), PC1 (bidir), PC2 (bidir), PC3 (bidir), PC4 (bidir), PC5 (bidir), PC6 (bidir), PC7 (bidir), PC13 (bidir), PD3 (bidir), PD6 (bidir), PE2 (bidir), PE3 (bidir), PE4 (bidir), PE5 (bidir), PE6 (bidir), PF6 (bidir), PF7 (bidir), PF8 (bidir), PF9 (bidir), PF10 (bidir), PF11 (bidir), PG6 (bidir), PG7 (bidir), PG8 (bidir), PG11 (bidir), PG12 (bidir), PG13 (bidir), PG14 (bidir), PG15 (bidir), RST_KEY (out), RXD1 (in), RXD2 (in), RXD3 (in), SDIO_CLK (out), SDIO_CMD (out), SDIO_D0 (bidir), SDIO_D1 (bidir), SDIO_D2 (bidir), SDIO_D3 (bidir), SPI1_CS (out), SPI1_MISO (in), SPI1_MOSI (out), SPI1_SCK (out), SPI2_CS_H_IN (out), SPI2_MISO (in), SPI2_MOSI (out), SPI2_SCK (out), SPI3_MISO (in), SPI3_MOSI (out), SPI3_SCK (out), TXD1 (out), TXD2 (out), TXD3 (out)

### Nets
+3V3: CS4.2 CS5.2 CS6.2 CS7.2 CS8.2 CS9.2 CS10.2 CS11.2 CS12.2 CS13.2 DS1.1(A) RS1.2 RS4.2 US1.17(VDD) US1.39(VDD) US1.52(VDD) US1.62(VDD) US1.72(VDD) US1.84(VDD) US1.95(VDD) US1.108(VDD) US1.121(VDD) US1.131(VDD) US1.144(VDD)
+5V: SWD.1
GND: CS1.1 CS2.1 CS3.1 CS4.1 CS5.1 CS6.1 CS7.1 CS8.1 CS9.1 CS10.1 CS11.1 CS12.1 CS13.1 CS14.1 CS15.1 CS16.1 CS17.1 CS18.1 RS2.1 RS3.1 S3.1 SWD.2 US1.16(VSS) US1.30(VSSA) US1.31(Vref-) US1.38(VSS) US1.51(VSS) US1.61(VSS) US1.71(VSS) US1.83(VSS) US1.94(VSS) US1.107(VSS) US1.120(VSS) US1.130(VSS) US1.143(VSS)
VBAT: DS1.2(K) US1.6(VBAT)
VDDA: CS14.2 CS15.2 CS16.2 RS4.1 US1.32(Vref+) US1.33(VDDA)
A0: US1.10(PF0/FSMC_A0) ; port FSMC_A0
A1: US1.11(PF1/FSMC_A1) ; port FSMC_A1
A2: US1.12(PF2/FSMC_A2) ; port FSMC_A2
A3: US1.13(PF3/FSMC_A3) ; port FSMC_A3
A4: US1.14(PF4/FSMC_A4) ; port FSMC_A4
A5: US1.15(PF5/FSMC_A5) ; port FSMC_A5
A6: US1.50(PF12/FSMC_A6) ; port FSMC_A6
A7: US1.53(PF13/FSMC_A7) ; port FSMC_A7
A8: US1.54(PF14/FSMC_A8) ; port FSMC_A8
A9: US1.55(PF15/FSMC_A9) ; port FSMC_A9
A10: US1.56(PG0/FSMC_A10) ; port FSMC_A10
A11: US1.57(PG1/FSMC_A11) ; port FSMC_A11
A12: US1.87(PG2/FSMC_A12) ; port FSMC_A12
A13: US1.88(PG3/FSMC_A13) ; port FSMC_A13
A14: US1.89(PG4/FSMC_A14) ; port FSMC_A14
A15: US1.90(PG5/FSMC_A15) ; port FSMC_A15
A16: US1.80(PD11/FSMC_A16) ; port FSMC_A16
A17: US1.81(PD12/FSMC_A17) ; port FSMC_A17
A18: US1.82(PD13/FSMC_A18) ; port FSMC_A18
BL_IN_PWM: US1.96(PC6/I2S2_MCK/TIM8_CH1/SDIO_D6) ; port PC6
BL_OUT_PWM: US1.97(PC7/I2S3_MCK/TIM8_CH2/SDIO_D7) ; port PC7
BOOT0: RS2.2 US1.138(BOOT0)
BOOT1: RS3.2 US1.48(PB2/BOOT1)
D0: US1.85(PD14/FSMC_D0) ; port FSMC_D0
D1: US1.86(PD15/FSMC_D1) ; port FSMC_D1
D2: US1.114(PD0/FSMC_D2) ; port FSMC_D2
D3: US1.115(PD1/FSMC_D3) ; port FSMC_D3
D4: US1.58(PE7/FSMC_D4) ; port FSMC_D4
D5: US1.59(PE8/FSMC_D5) ; port FSMC_D5
D6: US1.60(PE9/FSMC_D6) ; port FSMC_D6
D7: US1.63(PE10/FSMC_D7) ; port FSMC_D7
D8: US1.64(PE11/FSMC_D8) ; port FSMC_D8
D9: US1.65(PE12/FSMC_D9) ; port FSMC_D9
D10: US1.66(PE13/FSMC_D10) ; port FSMC_D10
D11: US1.67(PE14/FSMC_D11) ; port FSMC_D11
D12: US1.68(PE15/FSMC_D12) ; port FSMC_D12
D13: US1.77(PD8/FSMC_D13) ; port FSMC_D13
D14: US1.78(PD9/FSMC_D14) ; port FSMC_D14
D15: US1.79(PD10/FSMC_D15) ; port FSMC_D15
EN: US1.45(PC5/ADC12_IN15) ; port PC5
ESP8266_RST: US1.46(PB0/ADC12_IN8/TIM3_CH3/TIM8_CH2N) ; port PB0
GPIO0: US1.44(PC4/ADC12_IN14) ; port PC4
GPIO4: US1.19(PF7/ADC3_IN5/FSMC_NREG) ; port PF7
GPIO5: US1.47(PB1/ADC12_IN9/TIM3_CH4/TIM8_CH3N) ; port PB1
GPIO12: US1.42(PA6/SPI1_MISO/TIM8_BKIN/ADC12_IN6/TIM3_CH1) ; port SPI1_MISO
GPIO13: US1.43(PA7/SPI1_MOSI/TIM8_CH1N/ADC12_IN7/TIM3_CH2) ; port SPI1_MOSI
GPIO14: US1.41(PA5/SPI1_SCK/DAC_OUT2/ADC12_IN5) ; port SPI1_SCK
GPIO15: US1.40(PA4/SPI1_NSS/DAC_OUT1/USART2_CK/ADC12_IN4) ; port SPI1_CS
NBL0: US1.141(PE0/TIM4_ETR/FSMC_NBL0) ; port FSMC_NBL0
NBL1: US1.142(PE1/FSMC_NBL1) ; port FSMC_NBL1
NE1: US1.123(PD7/FSMC_NE1/FSMC_NCE2) ; port FSMC_NE1
NE2: US1.124(PG9/FSMC_NE2/FSMC_NCE3) ; port FSMC_NE2
NE3: US1.125(PG10/FSMC_NCE4_1/FSMC_NE3) ; port FSMC_NE3
NOE: US1.118(PD4/FSMC_NOE) ; port FSMC_NOE
nRST: CS1.2 RS1.1 S3.2 US1.25(NRST) ; port RST_KEY
NWE: US1.119(PD5/FSMC_NWE) ; port FSMC_NWE
SPI3_CS_S_IN: US1.1(PE2/TRACECK/FSMC_A23) ; port PE2
SPI3_CS_S_OUT: US1.2(PE3/TRACED0/FSMC_A19) ; port PE3
SPI3_MISO: US1.134(PB4/JNTRST/SPI3_MISO) ; port SPI3_MISO
SPI3_MOSI: US1.135(PB5/I2C1_SMBAI/SPI3_MOSI/I2S3_SD) ; port SPI3_MOSI
SPI3_SCK: US1.133(PB3/JTDO/TRACESWO/SPI3_SCK/I2S3_CK) ; port SPI3_SCK
TCK: SWD.4 US1.109(PA14/JTCK_SWCLK)
TMS: SWD.3 US1.105(PA13/JTMS_SWDIO)
TP_IN_IRQ: US1.136(PB6/I2C1_SCL/TIM4_CH1) ; port PB6
TP_OUT_IRQ: US1.137(PB7/I2C1_SDA/FSMC_NADV/TIM4_CH2) ; port PB7
NetCS2_2: CS2.2 US1.8(PC14-OSC32_IN) Y1.2(OSC2)
NetCS3_2: CS3.2 US1.9(PC15-OSC32_OUT) Y1.1(OSC1)
NetCS17_2: CS17.2 RS5.2 US1.23(OSC_IN) Y2.2(OSC2)
NetCS18_2: CS18.2 RS5.1 US1.24(OSC_OUT) Y2.1(OSC1)
NetFINGER_IN_3: US1.102(PA10/USART1_RX/TIM1_CH3) ; port RXD1
NetFINGER_IN_4: US1.101(PA9/USART1_TX/TIM1_CH2) ; port TXD1
NetFINGER_IN_5: US1.129(PG14/FSMC_A25) ; port PG14
NetFINGER_IN_6: US1.128(PG13/FSMC_A24) ; port PG13
NetFINGER_OUT_3: US1.70(PB11/I2C2_SDA/USART3_RX) ; port RXD3
NetFINGER_OUT_4: US1.69(PB10/I2C2_SCL/USART3_TX) ; port TXD3
NetFINGER_OUT_5: US1.126(PG11/FSMC_NCE4_2) ; port PG11
NetFINGER_OUT_6: US1.127(PG12/FSMC_NE4) ; port PG12
NetMY1_3: US1.3(PE4/TRACED1/FSMC_A20) ; port PE4
NetRB1_2: US1.34(PA0-WKUP/USART2_CTS/ADC123_IN0/TIM5_CH1/TIM2_CH1_ETR/TIM8_ETR) ; port PA0
NetRC522_IN_2: US1.93(PG8) ; port PG8
NetRC522_IN_4: US1.100(PA8/USART1_CK/TIM1_CH1/MCO) ; port PA8
NetRC522_IN_5: US1.75(PB14/SPI2_MISO/USART3_RTS/TIM1_CH2N) ; port SPI2_MISO
NetRC522_IN_6: US1.76(PB15/SPI2_MOSI/I2S2_SD/TIM1_CH3N) ; port SPI2_MOSI
NetRC522_IN_7: US1.74(PB13/SPI2_SCK/I2S2_CK/USART3_CTS/TIM1_CH1N) ; port SPI2_SCK
NetRC522_IN_8: US1.73(PB12/SPI2_NSS/I2S2_WS/I2C2_SMBAI/USART3_CK/TIM1BKIN) ; port SPI2_CS_H_IN
NetRC522_OUT_2: US1.91(PG6/FSMC_INT2) ; port PG6
NetRC522_OUT_4: US1.92(PG7/FSMC_INT3) ; port PG7
NetRC522_OUT_8: US1.110(PA15/JTDI/SPI3_NSS/I2S3_WS) ; port PA15
NetRD1_1: US1.140(PB9/TIM4_CH4/SDIO_D5) ; port IIC1_SDA
NetRD2_1: US1.139(PB8/TIM4_CH3/SDIO_D4) ; port IIC1_SCL
NetRD3_2: US1.5(PE6/TRACED3/FSMC_A22) ; port PE6
NetRE2_2: US1.37(PA3/USART2_RX/ADC123_IN3/TIM5_CH4/TIM2_CH4) ; port RXD2
NetRE3_2: US1.36(PA2/USART2_TX/ADC123_IN2/TIM5_CH3/TIM2_CH3) ; port TXD2
NetRT1_2: US1.111(PC10/UART4_TX/SDIO_D2) ; port SDIO_D2
NetRT2_2: US1.112(PC11/UART4_RX/SDIO_D3) ; port SDIO_D3
NetRT3_2: US1.116(PD2/TIM3_ETR/UART5_RX/SDIO_CMD) ; port SDIO_CMD
NetRT4_2: US1.113(PC12/UART5_TX/SDIO_CK) ; port SDIO_CLK
NetRT5_2: US1.98(PC8/TIM8_CH3/SDIO_D0) ; port SDIO_D0
NetRT6_2: US1.99(PC9/TIM8_CH4/SDIO_D1) ; port SDIO_D1
NetUS1_4: US1.4(PE5/TRACED2/FSMC_A21) ; port PE5
NetUS1_7: US1.7(PC13-TAMPER-RTC) ; port PC13
NetUS1_18: US1.18(PF6/ADC3_IN4/FSMC_NIORD) ; port PF6
NetUS1_20: US1.20(PF8/ADC3_IN6/FSMC_NIOWR) ; port PF8
NetUS1_21: US1.21(PF9/ADC3_IN7/FSMC_CD) ; port PF9
NetUS1_22: US1.22(PF10/ADC3_IN8/FSMC_INTR) ; port PF10
NetUS1_26: US1.26(PC0/ADC123_IN10) ; port PC0
NetUS1_27: US1.27(PC1/ADC123_IN11) ; port PC1
NetUS1_28: US1.28(PC2/ADC123_IN12) ; port PC2
NetUS1_29: US1.29(PC3/ADC123_IN13) ; port PC3
NetUS1_35: US1.35(PA1/USART2_RTS/ADC123_IN1/TIM5_CH2/TIM2_CH2) ; port PA1
NetUS1_49: US1.49(PF11/FSMC_NIOS16) ; port PF11
NetUS1_103: US1.103(PA11/USART1_CTS/CAN_RX/TIM1_CH4/USBDM) ; port PA11
NetUS1_104: US1.104(PA12/USART1_RTS/CAN_TX/TIM1_ETR/USBDP) ; port PA12
NetUS1_117: US1.117(PD3/FSMC_CLK) ; port PD3
NetUS1_122: US1.122(PD6/FSMC_NWAIT) ; port PD6
NetUS1_132: US1.132(PG15) ; port PG15

Not connected (* = marked no-connect by the designer): US1 106(NC)*

### Library data of the parts
CS1-CS18 = Cap1: Capacitor; Published: 8-Jun-2000; LatestRevisionDate: 17-Jul-2002; LatestRevisionNote: Re-released for DXP Platform.; PackageReference: RAD-0.3; Publisher: Altium Limited
RS1-RS5 = Res1: Resistor; Published: 8-Jun-2000; LatestRevisionDate: 17-Jul-2002; LatestRevisionNote: Re-released for DXP Platform.; PackageReference: AXIAL-0.4; Publisher: Altium Limited
S3 = SW-PB: Switch; Published: 24-Mar-1999; LatestRevisionDate: 17-Jul-2002; LatestRevisionNote: Re-released for DXP Platform.; PackageReference: SPST-2; Publisher: Altium Limited; PackageDescription: Switch; 2 Leads
SWD = Header 4: Header, 4-Pin; LatestRevisionDate: 17-Jul-2002; LatestRevisionNote: Re-released for DXP Platform.; Publisher: Altium Limited
Y1 Y2 = XTAL: Crystal Oscillator; Published: 8-Jun-2000; LatestRevisionDate: 17-Jul-2002; LatestRevisionNote: Re-released for DXP Platform.; PackageReference: R38; Publisher: Altium Limited; PackageDescription: Crystal, Thru-Hole; 2 Leads; Body 3.1 x 8.2 mm (Dia.xH)

## Sheet CONNECTOR.SchDoc
size A4
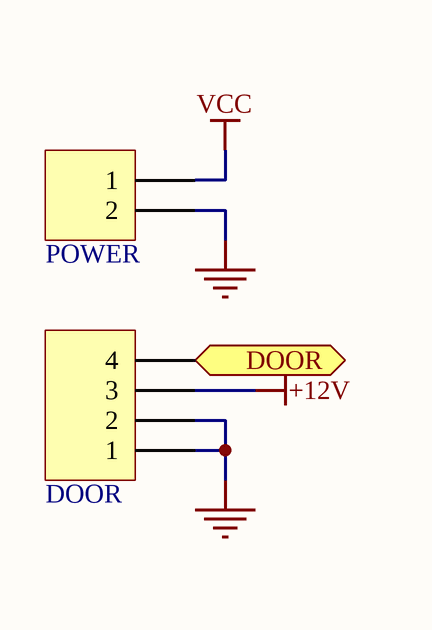
[diagram p12: CONNECTOR.SchDoc]

### Parts
DOOR  Header 4  [HX2.54-4]  (value not drawn)
POWER  Header 2  [HX2.54-2]  (value not drawn)

### Ports
DOOR (in)

### Nets
+12V: DOOR.3
GND: DOOR.1 DOOR.2 POWER.2
VCC: POWER.1
NetDOOR_4: DOOR.4 ; port DOOR

### Library data of the parts
DOOR = Header 4: Header, 4-Pin; LatestRevisionDate: 17-Jul-2002; LatestRevisionNote: Re-released for DXP Platform.; Publisher: Altium Limited
POWER = Header 2: Header, 2-Pin; LatestRevisionDate: 17-Jul-2002; LatestRevisionNote: Re-released for DXP Platform.; Publisher: Altium Limited

## Nets that join several sheets
+3V3: TF (9 pins), SRAM (5 pins), DS1307 (RD1.2 RD2.2 RD3.1), RC522 (CR1.1 CR2.1 RC522_IN.1 RC522_OUT.1), RELAY (RY1.2), POWER (CP9.1 UP4.2), STM32F103ZE (24 pins)
+5V: DS1307 (CD1.1 UD1.8), FINGER_PRINT (CF1.1 CF2.1 FINGER_IN.1 FINGER_OUT.1), BUZZER (RB3.2), POWER (12 pins), STM32F103ZE (SWD.1)
+12V: RELAY (RY2.2), POWER (CP1.1 SP1.1 SP1.6 UR1.1), CONNECTOR (DOOR.3)
GND: ESP8266 (5 pins), LCD (CL1.2 CL2.2 LCD_IN.2 LCD_OUT.1), TF (CT1.1 CT2.2 TF.6), SRAM (CM1.2 CM2.1 UM1.12 UM1.34), DS1307 (CD1.2 UD1.4), RC522 (CR1.2 CR2.2 RC522_IN.3 RC522_OUT.3), FINGER_PRINT (CF1.2 CF2.2 FINGER_IN.2 FINGER_OUT.2), BUZZER (QB1.2 RB2.2), RELAY (MY1.2), POWER (21 pins), STM32F103ZE (35 pins), CONNECTOR (DOOR.1 DOOR.2 POWER.2)
LCD_+3V3: LCD (CL1.1 CL2.1 LCD_IN.1 LCD_OUT.32), POWER (CP7.1 UP3.2)
VBAT: DS1307 (UD1.3), POWER (BAT.1), STM32F103ZE (DS1.2 US1.6)
VCC: POWER (FP1.1), CONNECTOR (POWER.1)
WIFI_+3V3: ESP8266 (CE1.1 UE1.8), POWER (CP5.1 UP2.2)
A0: LCD (LCD_IN.20 LCD_OUT.10), SRAM (UM1.24), STM32F103ZE (US1.10)
A1: SRAM (UM1.23), STM32F103ZE (US1.11)
A2: SRAM (UM1.19), STM32F103ZE (US1.12)
A3: SRAM (UM1.20), STM32F103ZE (US1.13)
A4: SRAM (UM1.21), STM32F103ZE (US1.14)
A5: SRAM (UM1.22), STM32F103ZE (US1.15)
A6: SRAM (UM1.18), STM32F103ZE (US1.50)
A7: SRAM (UM1.5), STM32F103ZE (US1.53)
A8: SRAM (UM1.4), STM32F103ZE (US1.54)
A9: SRAM (UM1.3), STM32F103ZE (US1.55)
A10: SRAM (UM1.2), STM32F103ZE (US1.56)
A11: SRAM (UM1.1), STM32F103ZE (US1.57)
A12: SRAM (UM1.27), STM32F103ZE (US1.87)
A13: SRAM (UM1.26), STM32F103ZE (US1.88)
A14: SRAM (UM1.25), STM32F103ZE (US1.89)
A15: SRAM (UM1.42), STM32F103ZE (US1.90)
A16: SRAM (UM1.43), STM32F103ZE (US1.80)
A17: SRAM (UM1.44), STM32F103ZE (US1.81)
A18: SRAM (UM1.28), STM32F103ZE (US1.82)
BL_IN_PWM: LCD (LCD_IN.24), STM32F103ZE (US1.96)
BL_OUT_PWM: LCD (LCD_OUT.12), STM32F103ZE (US1.97)
D0: LCD (LCD_IN.3 LCD_OUT.31), SRAM (UM1.7), STM32F103ZE (US1.85)
D1: LCD (LCD_IN.4 LCD_OUT.2), SRAM (UM1.8), STM32F103ZE (US1.86)
D2: LCD (LCD_IN.5 LCD_OUT.30), SRAM (UM1.9), STM32F103ZE (US1.114)
D3: LCD (LCD_IN.6 LCD_OUT.3), SRAM (UM1.10), STM32F103ZE (US1.115)
D4: LCD (LCD_IN.7 LCD_OUT.29), SRAM (UM1.13), STM32F103ZE (US1.58)
D5: LCD (LCD_IN.8 LCD_OUT.4), SRAM (UM1.14), STM32F103ZE (US1.59)
D6: LCD (LCD_IN.9 LCD_OUT.28), SRAM (UM1.15), STM32F103ZE (US1.60)
D7: LCD (LCD_IN.10 LCD_OUT.5), SRAM (UM1.16), STM32F103ZE (US1.63)
D8: LCD (LCD_IN.11 LCD_OUT.27), SRAM (UM1.29), STM32F103ZE (US1.64)
D9: LCD (LCD_IN.12 LCD_OUT.6), SRAM (UM1.30), STM32F103ZE (US1.65)
D10: LCD (LCD_IN.13 LCD_OUT.26), SRAM (UM1.31), STM32F103ZE (US1.66)
D11: LCD (LCD_IN.14 LCD_OUT.7), SRAM (UM1.32), STM32F103ZE (US1.67)
D12: LCD (LCD_IN.15 LCD_OUT.25), SRAM (UM1.35), STM32F103ZE (US1.68)
D13: LCD (LCD_IN.16 LCD_OUT.8), SRAM (UM1.36), STM32F103ZE (US1.77)
D14: LCD (LCD_IN.17 LCD_OUT.24), SRAM (UM1.37), STM32F103ZE (US1.78)
D15: LCD (LCD_IN.18 LCD_OUT.9), SRAM (UM1.38), STM32F103ZE (US1.79)
EN: ESP8266 (UE1.3), STM32F103ZE (US1.45)
ESP8266_RST: ESP8266 (RE1.1 UE1.1), STM32F103ZE (US1.46)
GPIO0: ESP8266 (RE4.1 UE1.12), STM32F103ZE (US1.44)
GPIO4: ESP8266 (UE1.13), STM32F103ZE (US1.19)
GPIO5: ESP8266 (UE1.14), STM32F103ZE (US1.47)
GPIO12: ESP8266 (UE1.6), STM32F103ZE (US1.42)
GPIO13: ESP8266 (UE1.7), STM32F103ZE (US1.43)
GPIO14: ESP8266 (UE1.5), STM32F103ZE (US1.41)
GPIO15: ESP8266 (UE1.10), STM32F103ZE (US1.40)
NBL0: SRAM (UM1.39), STM32F103ZE (US1.141)
NBL1: SRAM (UM1.40), STM32F103ZE (US1.142)
NE1: SRAM (RM1.2 UM1.6), STM32F103ZE (US1.123)
NE2: LCD (LCD_IN.19), STM32F103ZE (US1.124)
NE3: LCD (LCD_OUT.23), STM32F103ZE (US1.125)
NetDOOR_4: RELAY (MY1.1 RY2.1), CONNECTOR (DOOR.4)
NetFINGER_IN_3: FINGER_PRINT (FINGER_IN.3), STM32F103ZE (US1.102)
NetFINGER_IN_4: FINGER_PRINT (FINGER_IN.4), STM32F103ZE (US1.101)
NetFINGER_IN_5: FINGER_PRINT (FINGER_IN.5), STM32F103ZE (US1.129)
NetFINGER_IN_6: FINGER_PRINT (FINGER_IN.6), STM32F103ZE (US1.128)
NetFINGER_OUT_3: FINGER_PRINT (FINGER_OUT.3), STM32F103ZE (US1.70)
NetFINGER_OUT_4: FINGER_PRINT (FINGER_OUT.4), STM32F103ZE (US1.69)
NetFINGER_OUT_5: FINGER_PRINT (FINGER_OUT.5), STM32F103ZE (US1.126)
NetFINGER_OUT_6: FINGER_PRINT (FINGER_OUT.6), STM32F103ZE (US1.127)
NetMY1_3: RELAY (MY1.3 RY1.1), STM32F103ZE (US1.3)
NetRB1_2: BUZZER (RB1.2), STM32F103ZE (US1.34)
NetRC522_IN_2: RC522 (RC522_IN.2), STM32F103ZE (US1.93)
NetRC522_IN_4: RC522 (RC522_IN.4), STM32F103ZE (US1.100)
NetRC522_IN_5: RC522 (RC522_IN.5 RC522_OUT.5), STM32F103ZE (US1.75)
NetRC522_IN_6: RC522 (RC522_IN.6 RC522_OUT.6), STM32F103ZE (US1.76)
NetRC522_IN_7: RC522 (RC522_IN.7 RC522_OUT.7), STM32F103ZE (US1.74)
NetRC522_IN_8: RC522 (RC522_IN.8), STM32F103ZE (US1.73)
NetRC522_OUT_2: RC522 (RC522_OUT.2), STM32F103ZE (US1.91)
NetRC522_OUT_4: RC522 (RC522_OUT.4), STM32F103ZE (US1.92)
NetRC522_OUT_8: RC522 (RC522_OUT.8), STM32F103ZE (US1.110)
NetRD1_1: DS1307 (RD1.1 UD1.5), STM32F103ZE (US1.140)
NetRD2_1: DS1307 (RD2.1 UD1.6), STM32F103ZE (US1.139)
NetRD3_2: DS1307 (RD3.2 UD1.7), STM32F103ZE (US1.5)
NetRE2_2: ESP8266 (RE2.2), STM32F103ZE (US1.37)
NetRE3_2: ESP8266 (RE3.2), STM32F103ZE (US1.36)
NetRT1_2: TF (RT1.2 TF.1), STM32F103ZE (US1.111)
NetRT2_2: TF (RT2.2 TF.2), STM32F103ZE (US1.112)
NetRT3_2: TF (RT3.2 TF.3), STM32F103ZE (US1.116)
NetRT4_2: TF (RT4.2 TF.5), STM32F103ZE (US1.113)
NetRT5_2: TF (RT5.2 TF.7), STM32F103ZE (US1.98)
NetRT6_2: TF (RT6.2 TF.8), STM32F103ZE (US1.99)
NOE: LCD (LCD_IN.22 LCD_OUT.11), SRAM (UM1.41), STM32F103ZE (US1.118)
nRST: LCD (LCD_IN.23 LCD_OUT.21), STM32F103ZE (CS1.2 RS1.1 S3.2 US1.25)
NWE: LCD (LCD_IN.21 LCD_OUT.22), SRAM (UM1.17), STM32F103ZE (US1.119)
SPI3_CS_S_IN: LCD (LCD_IN.31), STM32F103ZE (US1.1)
SPI3_CS_S_OUT: LCD (LCD_OUT.17), STM32F103ZE (US1.2)
SPI3_MISO: LCD (LCD_IN.25 LCD_OUT.20), STM32F103ZE (US1.134)
SPI3_MOSI: LCD (LCD_IN.27 LCD_OUT.19), STM32F103ZE (US1.135)
SPI3_SCK: LCD (LCD_IN.29 LCD_OUT.18), STM32F103ZE (US1.133)
TP_IN_IRQ: LCD (LCD_IN.26), STM32F103ZE (US1.136)
TP_OUT_IRQ: LCD (LCD_OUT.13), STM32F103ZE (US1.137)